# EasyEDA schematic 1-Schematic_EMWAVER_DIY_V1.json
TITLE: Sheet_1; REV: 1.0; Date: 2025-06-19; Sheet: 1/1; Drawn By: maarnotto; Company: Your Company
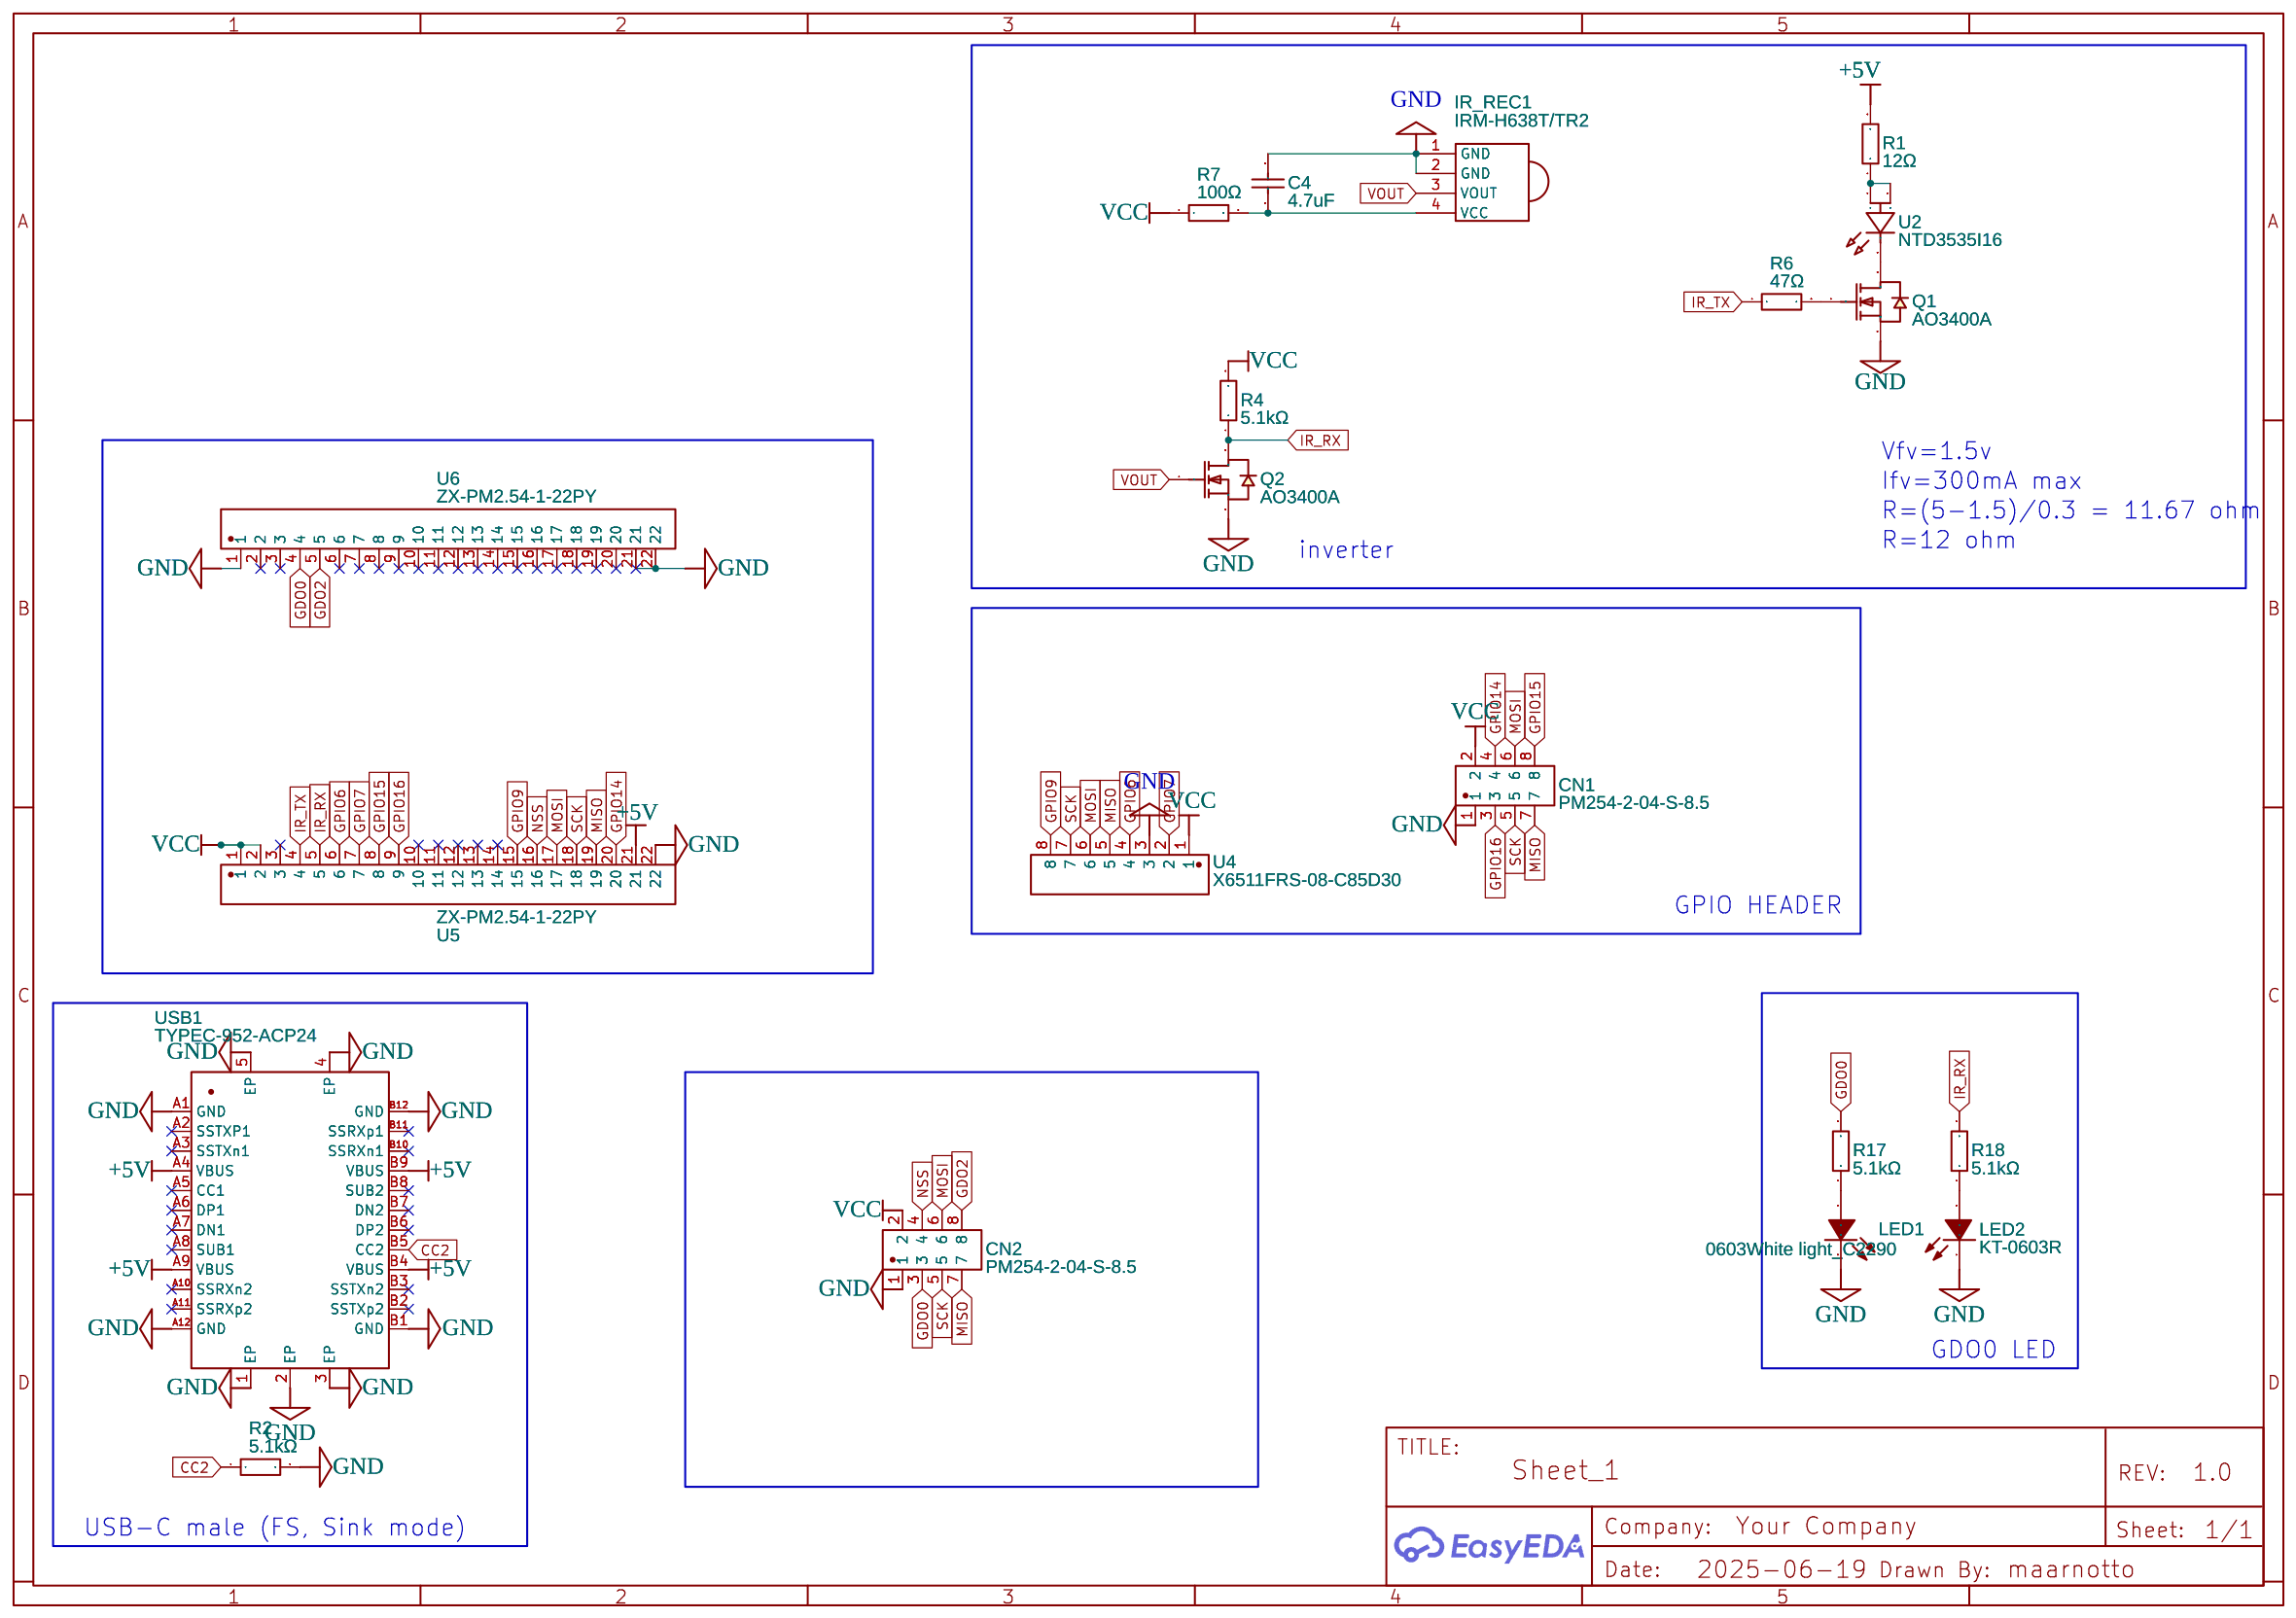
[diagram p0: schematic sheet]

## Parts
C4  4.7uF  [C0603]
CN1  PM254-2-04-S-8.5  [HDR-SMD_8P-P2.54-V-F-R2-C4-S7.1]
CN2  PM254-2-04-S-8.5  [HDR-SMD_8P-P2.54-V-F-R2-C4-S7.1]
IR_REC1  IRM-H638T/TR2  [SENSOR-SMD_IRM-H638T-TR2-TL]
LED1  0603White light_C2290  [LED0603-R-RD_WHITE]
LED2  KT-0603R  [LED0603-RD]
Q1  AO3400A  [SOT-23-3_L2.9-W1.6-P1.90-LS2.8-BR]
Q2  AO3400A  [SOT-23-3_L2.9-W1.6-P1.90-LS2.8-BR]
R1  12Ω  [R2512]
R2  5.1kΩ  [R0603]
R4  5.1kΩ  [R0603]
R6  47Ω  [R0805]
R7  100Ω  [R0805]
R17  5.1kΩ  [R0603]
R18  5.1kΩ  [R0603]
U2  NTD3535I16  [LED-SMD_3P-L3.5-W3.5-NTD3535I16]
U4  X6511FRS-08-C85D30  [HDR-SMD_8P-P2.54-H-F-L11.5]
U5  ZX-PM2.54-1-22PY  [HDR-TH_22P-P2.54-V-F]
U6  ZX-PM2.54-1-22PY  [HDR-TH_22P-P2.54-V-F]
USB1  TYPEC-952-ACP24  [USB-C-SMD_TYPEC-952-ACP24]

## Library data of the parts
C4 = CL10A475KO8NNNC: Supplier: LCSC; Manufacturer: SAMSUNG(三星); Supplier Part: C19666; JLCPCB Part Class: Basic Part
CN1 CN2 = PM254-2-04-S-8.5: Contributor: lcsc; Supplier: LCSC; Supplier Part: C3975149; Manufacturer: HCTL(华灿天禄); JLCPCB Part Class: Extended Part
IR_REC1 = IRM-H638T/TR2: Supplier: LCSC; Manufacturer: EVERLIGHT(亿光); Supplier Part: C91447; JLCPCB Part Class: Extended Part
LED1 = 0603White light_C2290: Supplier: LCSC; Manufacturer: KENTO; Manufacturer Part: KT-0603W; Supplier Part: C2290; JLCPCB Part Class: Basic Part
LED2 = KT-0603R: Supplier: LCSC; Manufacturer: KENTO; Supplier Part: C2286; JLCPCB Part Class: Basic Part
Q1 Q2 = AO3400A: Supplier: LCSC; Manufacturer: AOS; Supplier Part: C20917; JLCPCB Part Class: Basic Part
R1 = 25121WJ0120T4E: Supplier: LCSC; Manufacturer: UNI-ROYAL(厚声); Supplier Part: C32443; JLCPCB Part Class: Extended Part
R2 R4 R17 R18 = 0603WAF5101T5E: Supplier: LCSC; Manufacturer: UNI-ROYAL(厚声); Supplier Part: C23186; JLCPCB Part Class: Basic Part
R6 = 0805W8F470JT5E: Supplier: LCSC; Manufacturer: UNI-ROYAL(厚声); Supplier Part: C17714; JLCPCB Part Class: Basic Part
R7 = 0805W8F1000T5E: Supplier: LCSC; Manufacturer: UNI-ROYAL(厚声); Supplier Part: C17408; JLCPCB Part Class: Basic Part
U2 = NTD3535I16: Supplier: LCSC; Supplier Part: C7464756; Manufacturer: 国星光电; Contributor: lcsc; JLCPCB Part Class: Extended Part
U4 = X6511FRS-08-C85D30: Contributor: lcsc; Supplier: LCSC; Supplier Part: C5142241; Manufacturer: XKB Connectivity(中国星坤); JLCPCB Part Class: Extended Part
U5 U6 = ZX-PM2.54-1-22PY: Supplier: LCSC; Supplier Part: C7499337; Manufacturer: Megastar(兆星); Contributor: lcsc; JLCPCB Part Class: Extended Part
USB1 = TYPEC-952-ACP24: Contributor: LCSC; Supplier: LCSC; Supplier Part: C2840398; Manufacturer: XUNPU(讯普); JLCPCB Part Class: Extended Part

## Nets
+5V: R1.2 U5.21 USB1.A4(VBUS) USB1.A9(VBUS) USB1.B4(VBUS) USB1.B9(VBUS)
GND: C4.2 CN1.1 CN2.1 IR_REC1.1(GND) IR_REC1.2(GND) LED1.2(K) LED2.1(K) Q1.2(S) Q2.2(S) R2.2 U4.3 U5.22 U6.1 U6.21 U6.22 USB1.1(EP) USB1.2(EP) USB1.3(EP) USB1.4(EP) USB1.5(EP) USB1.A1(GND) USB1.A12(GND) USB1.B1(GND) USB1.B12(GND)
VCC: CN1.2 CN2.2 R4.2 R7.1 U4.1 U5.1 U5.2
CC2: R2.1 USB1.B5(CC2)
GDO0: CN2.3 R17.2 U6.4
GDO2: CN2.8 U6.5
GPIO6: U4.4 U5.6
GPIO7: U4.2 U5.7
GPIO9: U4.8 U5.15
GPIO14: CN1.4 U5.20
GPIO15: CN1.8 U5.8
GPIO16: CN1.3 U5.9
IR_RX: Q2.3(D) R4.1 R18.2 U5.5
IR_TX: R6.1 U5.4
MISO: CN1.7 CN2.7 U4.5 U5.19
MOSI: CN1.6 CN2.6 U4.6 U5.17
NSS: CN2.4 U5.16
SCK: CN1.5 CN2.5 U4.7 U5.18
VOUT: IR_REC1.3(VOUT) Q2.1(G)
Net-(C4-1): C4.1 IR_REC1.4(VCC) R7.2
Net-(LED1-1): LED1.1(A) R17.1
Net-(LED2-2): LED2.2(A) R18.1
Net-(Q1-1): Q1.1(G) R6.2
Net-(Q1-3): Q1.3(D) U2.3(K)
Net-(R1-1): R1.1 U2.1(A) U2.2

Not connected (* = marked no-connect by the designer): U5 3* 10* 11* 12* 13* 14*; U6 2* 3* 6* 7* 8* 9* 10* 11* 12* 13* 14* 15* 16* 17* 18* 19* 20*; USB1 A2(SSTXP1)* A3(SSTXn1)* A5(CC1)* A6(DP1)* A7(DN1)* A8(SUB1)* A10(SSRXn2)* A11(SSRXp2)* B2(SSTXp2)* B3(SSTXn2)* B6(DP2)* B7(DN2)* B8(SUB2)* B10(SSRXn1)* B11(SSRXp1)*

## Notes on the sheet
- Vfv=1.5v
- Ifv=300mA max
- R=(5-1.5)/0.3 = 11.67 ohm
- R=12 ohm
- inverter
- GPIO HEADER
- GDO0 LED
- USB-C male (FS, Sink mode)
